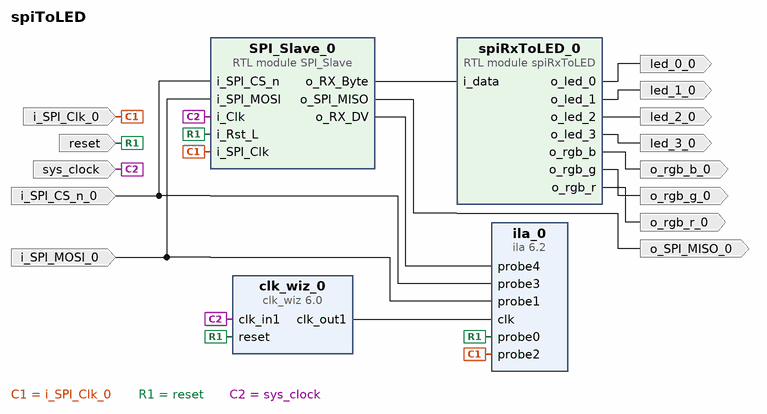
[diagram p0: block diagram of the top level]
# Vivado block design spiToLED, xc7s25csga225-1, Vivado 2022.1.1
create_bd_design spiToLED

create_bd_port -dir I -type clk sys_clock
set_property -dict {CONFIG.FREQ_HZ 12000000 CONFIG.PHASE 0.0} [get_bd_ports sys_clock]
create_bd_port -dir I -type rst reset
set_property -dict {CONFIG.POLARITY ACTIVE_HIGH} [get_bd_ports reset]
create_bd_port -dir I i_SPI_MOSI_0
create_bd_port -dir I i_SPI_CS_n_0
create_bd_port -dir O o_SPI_MISO_0
create_bd_port -dir I -type clk i_SPI_Clk_0
create_bd_port -dir O led_0_0
create_bd_port -dir O led_1_0
create_bd_port -dir O o_rgb_g_0
create_bd_port -dir O o_rgb_r_0
create_bd_port -dir O led_3_0
create_bd_port -dir O led_2_0
create_bd_port -dir O o_rgb_b_0

create_bd_cell -type ip -vlnv xilinx.com:ip:clk_wiz:6.0 clk_wiz_0
set_property -dict [list \
  CONFIG.CLK_IN1_BOARD_INTERFACE sys_clock \
  CONFIG.RESET_BOARD_INTERFACE reset \
  CONFIG.USE_BOARD_FLOW true \
] [get_bd_cells clk_wiz_0]
create_bd_cell -type module -reference SPI_Slave SPI_Slave_0
create_bd_cell -type ip -vlnv xilinx.com:ip:ila:6.2 ila_0
set_property -dict [list \
  CONFIG.C_DATA_DEPTH 16384 \
  CONFIG.C_ENABLE_ILA_AXI_MON false \
  CONFIG.C_MONITOR_TYPE Native \
  CONFIG.C_NUM_OF_PROBES 5 \
] [get_bd_cells ila_0]
create_bd_cell -type module -reference spiRxToLED spiRxToLED_0

# ---- connections ----

connect_bd_net [get_bd_pins SPI_Slave_0/o_RX_Byte] [get_bd_pins spiRxToLED_0/i_data]
connect_bd_net [get_bd_pins SPI_Slave_0/o_RX_DV] [get_bd_pins ila_0/probe4]
connect_bd_net [get_bd_pins SPI_Slave_0/o_SPI_MISO] [get_bd_ports o_SPI_MISO_0]
connect_bd_net [get_bd_pins clk_wiz_0/clk_out1] [get_bd_pins ila_0/clk]
connect_bd_net -net i_SPI_CS_n_0_1 [get_bd_ports i_SPI_CS_n_0] [get_bd_pins SPI_Slave_0/i_SPI_CS_n] [get_bd_pins ila_0/probe3]
connect_bd_net -net i_SPI_Clk_0_1 [get_bd_ports i_SPI_Clk_0] [get_bd_pins SPI_Slave_0/i_SPI_Clk] [get_bd_pins ila_0/probe2]
connect_bd_net -net i_SPI_MOSI_0_1 [get_bd_ports i_SPI_MOSI_0] [get_bd_pins SPI_Slave_0/i_SPI_MOSI] [get_bd_pins ila_0/probe1]
connect_bd_net [get_bd_ports reset] [get_bd_pins clk_wiz_0/reset] [get_bd_pins SPI_Slave_0/i_Rst_L] [get_bd_pins ila_0/probe0]
connect_bd_net [get_bd_pins spiRxToLED_0/o_led_0] [get_bd_ports led_0_0]
connect_bd_net [get_bd_pins spiRxToLED_0/o_led_1] [get_bd_ports led_1_0]
connect_bd_net [get_bd_pins spiRxToLED_0/o_led_2] [get_bd_ports led_2_0]
connect_bd_net [get_bd_pins spiRxToLED_0/o_led_3] [get_bd_ports led_3_0]
connect_bd_net [get_bd_pins spiRxToLED_0/o_rgb_b] [get_bd_ports o_rgb_b_0]
connect_bd_net [get_bd_pins spiRxToLED_0/o_rgb_g] [get_bd_ports o_rgb_g_0]
connect_bd_net [get_bd_pins spiRxToLED_0/o_rgb_r] [get_bd_ports o_rgb_r_0]
connect_bd_net [get_bd_ports sys_clock] [get_bd_pins clk_wiz_0/clk_in1] [get_bd_pins SPI_Slave_0/i_Clk]

validate_bd_design
save_bd_design
